# Altium schematic sheet Sheet_1_2020-04-24_02-18-40.schdoc
size 256 x 177 mm
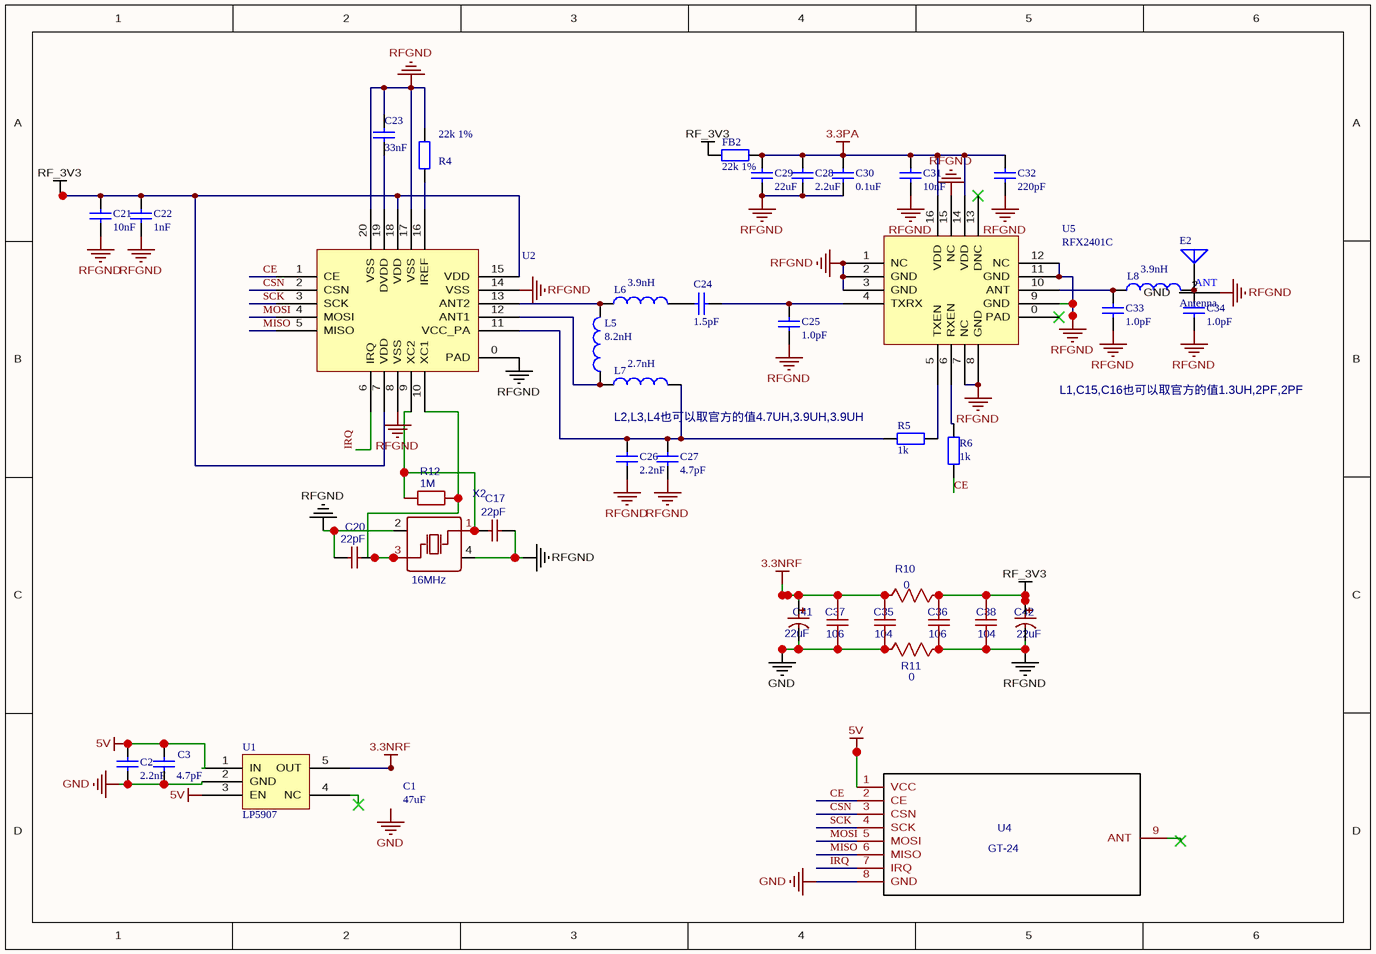
[diagram p0: Sheet_1_2020-04-24_02-18-40.schdoc]

## Parts
C1  47uF  [0805]
C2  2.2nF  [AP-04021]
C3  4.7pF  [AP-04021]
C17  22pF  [AP-04021]
C20  22pF  [AP-04021]
C21  10nF  [AP-04021]
C22  1nF  [AP-04021]
C23  33nF  [AP-04021]
C24  1.5pF  [AP-04021]
C25  1.0pF  [AP-04021]
C26  2.2nF  [AP-04021]
C27  4.7pF  [AP-04021]
C28  2.2uF  [AP-04021]
C29  22uF  [C_0603]
C30  0.1uF  [AP-04021]
C31  10nF  [AP-04021]
C32  220pF  [AP-04021]
C33  1.0pF  [AP-04021]
C34  1.0pF  [AP-04021]
C35  104  [AP-04021]
C36  106  [AP-04021]
C37  106  [AP-04021]
C38  104  [AP-04021]
C41  22uF  [AP-04021]
C42  22uF  [AP-04021]
E2  Antenna  [IPEX]
FB2  22k 1%  [C_0603]
L5  8.2nH  [AP-04021]
L6  3.9nH  [AP-04021]
L7  2.7nH  [AP-04021]
L8  3.9nH  [AP-04021]
R4  22k 1%  [AP-04021]
R5  1k  [AP-04021]
R6  1k  [AP-04021]
R10  0  [AP-04021]
R11  0  [AP-04021]
R12  1M  [AP-04021]
U1  LP5907  [SOT23-5]
U2  NRF24L01  [NRF24L01]  (value not drawn)
U4  GT-24  [GT-24-1]
U5  RFX2401C  [RFX2401C]
X2  16MHz  [OSC-SMD_4P-L3.2-W2.5-BL]

## Nets
3.3NRF: C35.2 C37.2 C41.1 R10.1 U1.5(OUT)
3.3PA: C28.1 C29.1 C30.1 C31.1 C32.1 FB2.2 U5.14(VDD) U5.16(VDD)
5V: C2.1 C3.1 U1.1(IN) U1.3(EN) U4.1(VCC)
GND: C2.2 C3.2 C35.1 C37.1 C41.2 R11.1 U1.2(GND) U4.8(GND)
RF_3V3: C21.1 C22.1 C36.2 C38.2 C42.1 FB2.1 R10.2 U2.7(VDD) U2.15(VDD) U2.18(VDD)
RFGND: C17.2 C20.1 C21.2 C22.2 C23.1 C25.2 C26.2 C27.2 C28.2 C29.2 C30.2 C31.2 C32.2 C33.2 C34.2 C36.1 C38.1 C42.2 E2.2(GND) R4.1 R11.2 U2.0(PAD) U2.8(VSS) U2.14(VSS) U2.17(VSS) U2.20(VSS) U5.1(NC) U5.2(GND) U5.3(GND) U5.7(NC) U5.8(GND) U5.9(GND) U5.11(GND) U5.12(NC) U5.15(NC) X2.2(GND) X2.4(GND)
ANT: C34.1 E2.1(ANT) L8.2
CE: R6.1 U2.1(CE) U4.2(CE)
CSN: U2.2(CSN) U4.3(CSN)
IRQ: U2.6(IRQ) U4.7(IRQ)
MISO: U2.5(MISO) U4.6(MISO)
MOSI: U2.4(MOSI) U4.5(MOSI)
SCK: U2.3(SCK) U4.4(SCK)
NetC17_1: C17.1 R12.1 U2.9(XC2) X2.1(OSC1)
NetC20_2: C20.2 R12.2 U2.10(XC1) X2.3(OSC2)
NetC23_2: C23.2 U2.19(DVDD)
NetC24_1: C24.1 L6.2
NetC24_2: C24.2 C25.1 U5.4(TXRX)
NetC26_1: C26.1 C27.1 L7.2 R5.1 U2.11(VCC_PA)
NetC33_1: C33.1 L8.1 U5.10(ANT)
NetL5_1: L5.1 L7.1 U2.12(ANT1)
NetL5_2: L5.2 L6.1 U2.13(ANT2)
NetR4_2: R4.2 U2.16(IREF)
NetR5_2: R5.2 U5.5(TXEN)
NetR6_2: R6.2 U5.6(RXEN)

Not connected (* = marked no-connect by the designer): U1 4(NC)*; U4 9(ANT)*; U5 0(PAD)* 13(DNC)*

## Notes on the sheet
- L2,L3,L4也可以取官方的值4.7UH,3.9UH,3.9UH
- L1,C15,C16也可以取官方的值1.3UH,2PF,2PF
- Labels drawn without touching a wire or pin: GND

## Library data of the parts
C17 C20 = 22pF: BOM_Manufacturer: YAGEO; BOM_Manufacturer Part: CC0402JRNPO9BN220; nameAlias: Capacitance; BOM_Supplier: LCSC; BOM_Supplier Part: C106203; spicePre: C; spiceSymbolName: CC0402JRNPO9BN220
C35 C38 = 104: nameAlias: Value(F); spicePre: C; spiceSymbolName: Cap_0402_US
C36 C37 = 106: nameAlias: Value(F); spicePre: C; spiceSymbolName: Cap_0402_US
C41 C42 = 22uF: BOM_Manufacturer: ValuePro; BOM_Manufacturer Part: 22uF 16V 5*11; Voltage: 16V; Value: 22uF; BOM_Supplier: LCSC; spicePre: C; BOM_Supplier Part: C43844
L5 = 8.2nH: Code_IEC: 1005; Published: 8-Jun-2000; LatestRevisionDate: 29-May-2009; LatestRevisionNote: IPC-7351 Footprint Added.; PackageReference: 0402-A; Publisher: Altium Limited; PackageDescription: Chip Inductor; Code_JEITA: 0402
L6 L8 = 3.9nH: Code_IEC: 1005; Published: 8-Jun-2000; LatestRevisionDate: 29-May-2009; LatestRevisionNote: IPC-7351 Footprint Added.; PackageReference: 0402-A; Publisher: Altium Limited; PackageDescription: Chip Inductor; Code_JEITA: 0402
L7 = 2.7nH: Code_IEC: 1005; Published: 8-Jun-2000; LatestRevisionDate: 29-May-2009; LatestRevisionNote: IPC-7351 Footprint Added.; PackageReference: 0402-A; Publisher: Altium Limited; PackageDescription: Chip Inductor; Code_JEITA: 0402
R10 R11 = 0: nameAlias: Value(Ω); spicePre: R; spiceSymbolName: Res_0402(1/16W)_US
R12 = 1M: BOM_Manufacturer: YAGEO; BOM_Manufacturer Part: AC0402DR-071ML; nameAlias: Resistance (Ohms); Contributor: LCSC; BOM_Supplier: LCSC; BOM_Supplier Part: C226699; spicePre: R; spiceSymbolName: AC0402DR-071ML
U4 = GT-24: Contributor: A-XIN560700; BOM_Supplier Part: undefined; spicePre: U; spiceSymbolName: GT-24
X2 = 16MHz: BOM_Manufacturer: TAE; BOM_Manufacturer Part: SMD-3225_4P16M9pf10ppm; nameAlias: Frequency; Contributor: LCSC; SMT Type: Extend; BOM_Supplier: LCSC; BOM_Supplier Part: C133335; BOM_LCSC Assembly: Yes; spicePre: X; spiceSymbolName: SMD-3225_4P16M9PF10PPM
C1 = 47uF: Published: 8-Jun-2000; LatestRevisionDate: 17-Jul-2002; LatestRevisionNote: Re-released for DXP Platform.; PackageReference: RAD-0.3; Publisher: Altium Limited; PackageDescription: Radial Cap, Thru-Hole; 2 Leads; 0.3 in Pin Spacing
C2 C26 = 2.2nF: Published: 8-Jun-2000; LatestRevisionDate: 17-Jul-2002; LatestRevisionNote: Re-released for DXP Platform.; PackageReference: RAD-0.3; Publisher: Altium Limited; PackageDescription: Radial Cap, Thru-Hole; 2 Leads; 0.3 in Pin Spacing
C3 C27 = 4.7pF: Published: 8-Jun-2000; LatestRevisionDate: 17-Jul-2002; LatestRevisionNote: Re-released for DXP Platform.; PackageReference: RAD-0.3; Publisher: Altium Limited; PackageDescription: Radial Cap, Thru-Hole; 2 Leads; 0.3 in Pin Spacing
C21 C31 = 10nF: Published: 8-Jun-2000; LatestRevisionDate: 17-Jul-2002; LatestRevisionNote: Re-released for DXP Platform.; PackageReference: RAD-0.3; Publisher: Altium Limited; PackageDescription: Radial Cap, Thru-Hole; 2 Leads; 0.3 in Pin Spacing
C22 = 1nF: Published: 8-Jun-2000; LatestRevisionDate: 17-Jul-2002; LatestRevisionNote: Re-released for DXP Platform.; PackageReference: RAD-0.3; Publisher: Altium Limited; PackageDescription: Radial Cap, Thru-Hole; 2 Leads; 0.3 in Pin Spacing
C23 = 33nF: Published: 8-Jun-2000; LatestRevisionDate: 17-Jul-2002; LatestRevisionNote: Re-released for DXP Platform.; PackageReference: RAD-0.3; Publisher: Altium Limited; PackageDescription: Radial Cap, Thru-Hole; 2 Leads; 0.3 in Pin Spacing
C24 = 1.5pF: Published: 8-Jun-2000; LatestRevisionDate: 17-Jul-2002; LatestRevisionNote: Re-released for DXP Platform.; PackageReference: RAD-0.3; Publisher: Altium Limited; PackageDescription: Radial Cap, Thru-Hole; 2 Leads; 0.3 in Pin Spacing
C25 C33 C34 = 1.0pF: Published: 8-Jun-2000; LatestRevisionDate: 17-Jul-2002; LatestRevisionNote: Re-released for DXP Platform.; PackageReference: RAD-0.3; Publisher: Altium Limited; PackageDescription: Radial Cap, Thru-Hole; 2 Leads; 0.3 in Pin Spacing
C28 = 2.2uF: Published: 8-Jun-2000; LatestRevisionDate: 17-Jul-2002; LatestRevisionNote: Re-released for DXP Platform.; PackageReference: RAD-0.3; Publisher: Altium Limited; PackageDescription: Radial Cap, Thru-Hole; 2 Leads; 0.3 in Pin Spacing
C29 = 22uF: Published: 8-Jun-2000; LatestRevisionDate: 17-Jul-2002; LatestRevisionNote: Re-released for DXP Platform.; PackageReference: RAD-0.3; Publisher: Altium Limited; PackageDescription: Radial Cap, Thru-Hole; 2 Leads; 0.3 in Pin Spacing
C30 = 0.1uF: Published: 8-Jun-2000; LatestRevisionDate: 17-Jul-2002; LatestRevisionNote: Re-released for DXP Platform.; PackageReference: RAD-0.3; Publisher: Altium Limited; PackageDescription: Radial Cap, Thru-Hole; 2 Leads; 0.3 in Pin Spacing
C32 = 220pF: Published: 8-Jun-2000; LatestRevisionDate: 17-Jul-2002; LatestRevisionNote: Re-released for DXP Platform.; PackageReference: RAD-0.3; Publisher: Altium Limited; PackageDescription: Radial Cap, Thru-Hole; 2 Leads; 0.3 in Pin Spacing
E2 = Antenna: Published: 24-Mar-1999; LatestRevisionDate: 17-Jul-2002; LatestRevisionNote: Re-released for DXP Platform.; PackageReference: PIN1; Publisher: Altium Limited
FB2 R4 = 22k 1%: Published: 8-Jun-2000; LatestRevisionDate: 17-Jul-2002; LatestRevisionNote: Re-released for DXP Platform.; PackageReference: AXIAL-0.4; Publisher: Altium Limited; PackageDescription: Axial Device, Thru-Hole; 2 Leads; 0.4 in Pin Spacing
R5 R6 = 1k: Published: 8-Jun-2000; LatestRevisionDate: 17-Jul-2002; LatestRevisionNote: Re-released for DXP Platform.; PackageReference: AXIAL-0.4; Publisher: Altium Limited; PackageDescription: Axial Device, Thru-Hole; 2 Leads; 0.4 in Pin Spacing